# EasyEDA schematic 鱼缸监测_2021-03-13.json
TITLE: Sheet_1; REV: 1.0; Date: 2020-02-20; Sheet: 1/1; Drawn By: foggyhlw; Company: Your Company
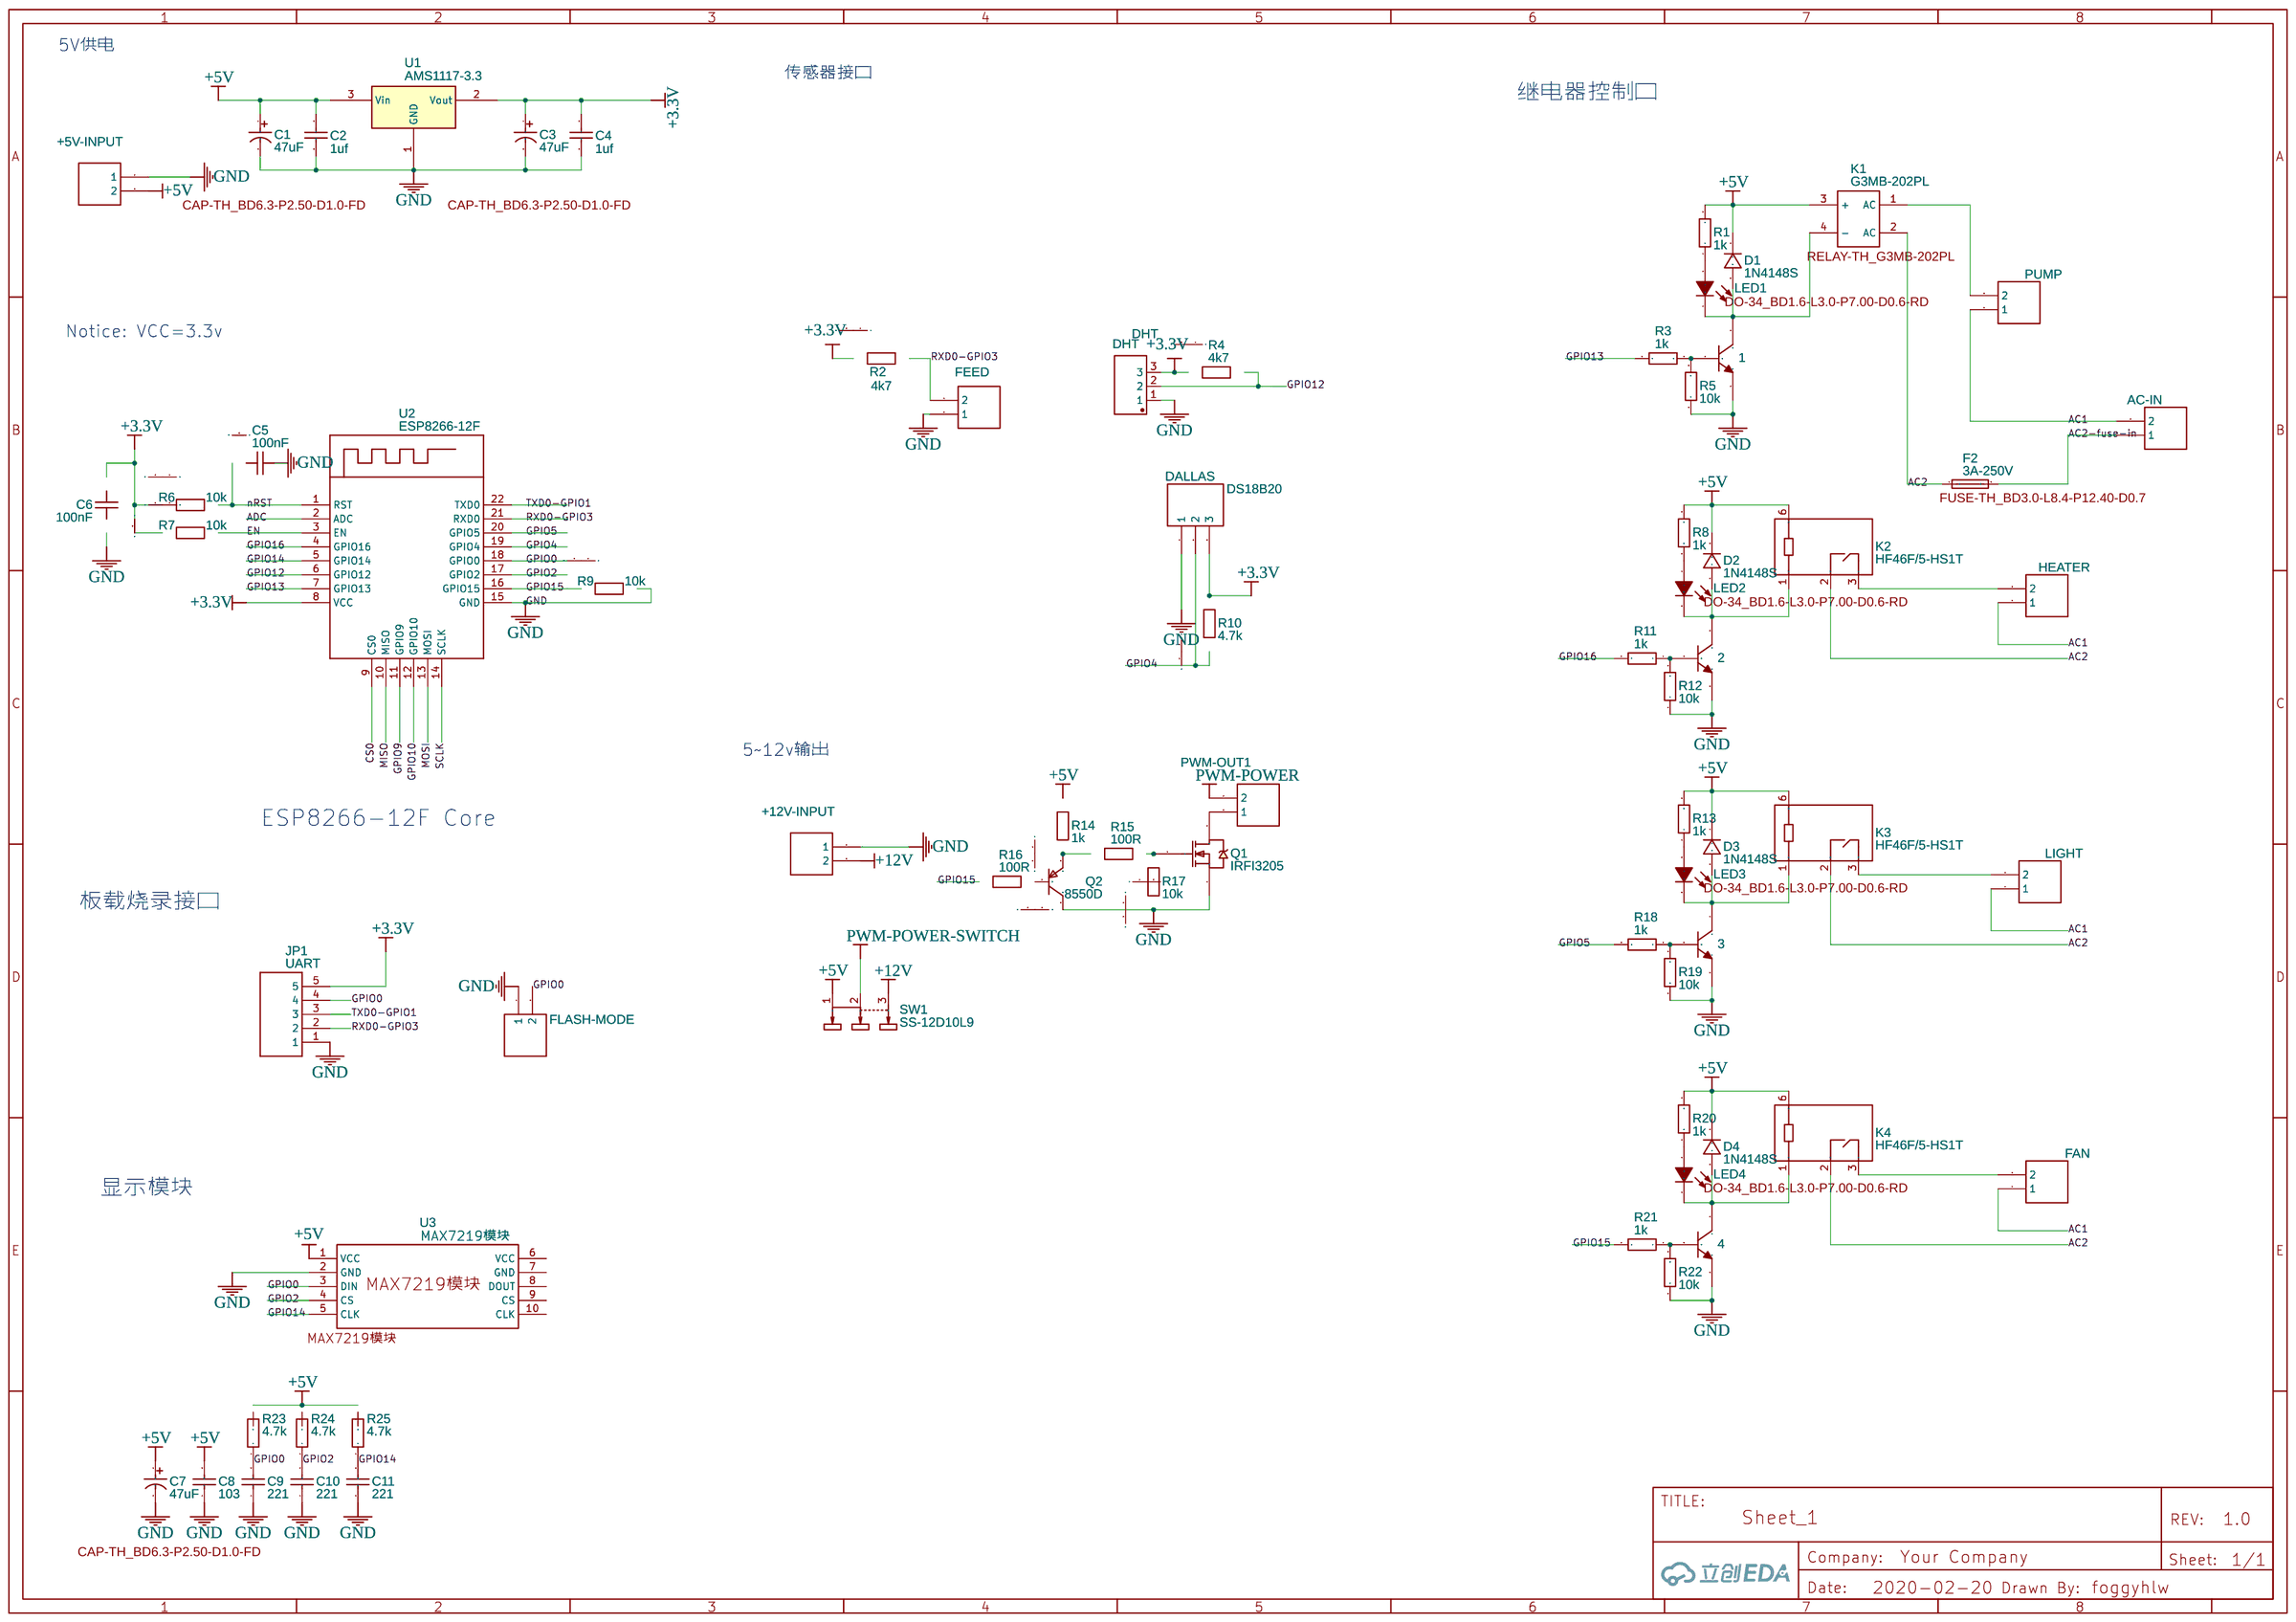
[diagram p0: schematic sheet]

## Parts
1  8050M-D  [TO-92-3_L4.8-W3.7-P2.54-R]
2  8050M-D  [TO-92-3_L4.8-W3.7-P2.54-R]
3  8050M-D  [TO-92-3_L4.8-W3.7-P2.54-R]
4  8050M-D  [TO-92-3_L4.8-W3.7-P2.54-R]
+5V-INPUT  SIP2  [CONN-TH_2P-P5.08_DB2EVC-5.08-2P]
+12V-INPUT  SIP2  [CONN-TH_2P-P5.08_DB2EVC-5.08-2P]
AC-IN  SIP2  [CONN-TH_2P-P5.08_DB2EVC-5.08-2P-BK]
C1  47uF  [CAP-TH_BD6.3-P2.50-D1.0-FD]
C2  1uf  [C0805]
C3  47uF  [CAP-TH_BD6.3-P2.50-D1.0-FD]
C4  1uf  [C0805]
C5  100nF  [C0603]
C6  100nF  [C0603]
C7  47uF  [CAP-TH_BD6.3-P2.50-D1.0-FD]
C8  103  [0603]
C9  221  [0603]
C10  221  [0603]
C11  221  [0603]
D1  1N4148S  [DO-34_BD1.6-L3.0-P7.00-D0.6-RD]
D2  1N4148S  [DO-34_BD1.6-L3.0-P7.00-D0.6-RD]
D3  1N4148S  [DO-34_BD1.6-L3.0-P7.00-D0.6-RD]
D4  1N4148S  [DO-34_BD1.6-L3.0-P7.00-D0.6-RD]
DALLAS  DS18B20  [HDR1X3]
DHT  DHT  [HDR1X3]
F2  3A-250V  [FUSE-TH_BD3.0-L8.4-P12.40-D0.7]
FAN  SIP2  [CONN-TH_2P-P5.08_DB2EV-5.08-2P-BK]
FEED  SIP2  [HDR1X2]
FLASH-MODE  SIP2  [HDR-TH_2P-P2.54-V-M]
HEATER  SIP2  [CONN-TH_2P-P5.08_DB2EVC-5.08-2P-BK]
JP1  UART  [HDR-TH_5P-P2.54-V_Z-211-0511-0021-001]
K1  G3MB-202PL  [RELAY-TH_G3MB-202PL]
K2  HF46F/5-HS1T  [RELAY-TH_HF46F/5-HS1T]
K3  HF46F/5-HS1T  [RELAY-TH_HF46F/5-HS1T]
K4  HF46F/5-HS1T  [RELAY-TH_HF46F/5-HS1T]
LED1  19-213/R6C-AN2Q1B/3T  [LED-TH_BD5.9-P2.54-FD]
LED2  19-213/R6C-AN2Q1B/3T  [LED-TH_BD5.9-P2.54-FD]
LED3  19-213/R6C-AN2Q1B/3T  [LED-TH_BD5.9-P2.54-FD]
LED4  19-213/R6C-AN2Q1B/3T  [LED-TH_BD5.9-P2.54-FD]
LIGHT  SIP2  [CONN-TH_2P-P5.08_DB2EVC-5.08-2P-BK]
PUMP  SIP2  [CONN-TH_2P-P5.08_DB2EVC-5.08-2P-BK]
PWM-OUT1  SIP2  [CONN-TH_2P-P5.08_DB2EVC-5.08-2P-BK]
Q1  IRFI3205  [TO-220-3_L10.0-W4.5-P2.54-L]
Q2  8550D  [TO-92-3_L4.8-W3.7-P2.54-R]
R1  1k  [R0805]
R2  4k7  [R0805]
R3  1k  [R0805]
R4  4k7  [R0805]
R5  10k  [R0805]
R6  10k  [R0805]
R7  10k  [R0805]
R8  1k  [R0805]
R9  10k  [R0805]
R10  4.7k  [R0805]
R11  1k  [R0805]
R12  10k  [R0805]
R13  1k  [R0805]
R14  1k  [R0805]
R15  100R  [R0805]
R16  100R  [R0805]
R17  10k  [R0805]
R18  1k  [R0805]
R19  10k  [R0805]
R20  1k  [R0805]
R21  1k  [R0805]
R22  10k  [R0805]
R23  4.7k  [R0805]
R24  4.7k  [R0805]
R25  4.7k  [R0805]
SW1  SS-12D10L9  [SW-TH_SS-12D10L9]
U1  AMS1117-3.3  [AMS1117]
U2  ESP8266-12F  [LGA22-2.0-24X16MM]
U3  MAX7219模块  [MAX7219模块]

## Library data of the parts
1-4 = -: Supplier: LCSC; Supplier Part: C305452; Manufacturer: BLUE ROCKET; Contributor: LCSC; LCSC Assembly: Yes
+5V-INPUT +12V-INPUT AC-IN DALLAS FAN FEED FLASH-MODE HEATER LIGHT PUMP PWM-OUT1 = -: catid: 20; Manufacturer Part: ?
C1 C3 C7 = 25V 47uF: Supplier: LCSC; Manufacturer: ValuePro; Manufacturer Part: 电解电容25V 47uF; Supplier Part: C45704; Package Display: Yes
C2 C4 = -: Capacitor; catid: 20; sourceId: aYgasJ1jB; Manufacturer Part: ?
C5 C6 = Capacitor: Manufacturer Part: ?
C8-C11 = Cap: Contributor: qjgdwxh; Package Display: No
D1-D4 = 1N4148S: Supplier: LCSC; Supplier Part: C179555; Manufacturer: Suzhou Good-Ark Elec; Contributor: LCSC; Package Display: Yes
DHT = -: Supplier: EasyEDA; Manufacturer Part: ?; Supplier Part: E8430
F2 = 3A-250V: Supplier: LCSC; Manufacturer Part: 保险管3A-250V,带引脚 双帽; Manufacturer: XCFuse; Supplier Part: C47403; Package Display: Yes
JP1 = 5PIN
K1 = G3MB-202PL: Supplier: LCSC; Manufacturer: OMRON; Supplier Part: C48654; Package Display: Yes
K2-K4 = HF46F/5-HS1T: Supplier: LCSC; Supplier Part: C182930; Manufacturer: Xiamen Hongfa Electroacoustic; Contributor: LCSC
LED1-LED4 = -: Supplier: LCSC; Supplier Part: C128251; Manufacturer: Everlight Elec; Contributor: LCSC
Q1 = -: HEXFET Power MOSFET
Q2 = 8550D: Supplier: LCSC; Manufacturer: SEMTECH; Contributor: LCSC; Supplier Part: C118549
R1 R3 R5 R8 R11-R13 R18-R22 = Res_0603(1/10W)_EU: Manufacturer Part: ?
R2 R4 R6 R7 R9 R10 R14-R17 R23-R25 = Resistor: Manufacturer Part: ?
SW1 = SS-12D10L9: Supplier: LCSC; Supplier Part: C319011; Manufacturer: XKB Enterprise; Contributor: LCSC
U1 = -: catid: 20; sourceId: 0Q2ZvNHZv; Manufacturer Part: ?
U2 = -: SMD ESP8266 based WiFi module FCC/CE; catid: 20; Manufacturer Part: ESP8266-12F/ESP-12F; sourceId: K4gQpZzx7
U3 = MAX7219模块: Contributor: Kano; Package Display: Yes

## Nets
+3.3V: C3.1 C4.2 C6.2 DALLAS.3 DHT.3 JP1.5 R2.1 R4.1 R6.1 R7.1 R10.2 U1.2(Vout) U2.8(VCC)
+5V: +5V-INPUT.2 C1.1 C2.2 C7.1 C8.2 D1.1 D2.1 D3.1 D4.1 K1.3(+) K2.6 K3.6 K4.6 R1.2 R8.2 R13.2 R14.2 R20.2 R23.2 R24.2 R25.2 SW1.1 U1.3(Vin) U3.1(VCC)
+12V: +12V-INPUT.2 SW1.3
GND: 1.3(E) 2.3(E) 3.3(E) 4.3(E) +5V-INPUT.1 +12V-INPUT.1 C1.2 C2.1 C3.2 C4.1 C5.2 C6.1 C7.2 C8.1 C9.1 C10.1 C11.1 DALLAS.1 DHT.1 FEED.1 FLASH-MODE.1 JP1.1 Q1.3(S) Q2.1(C) R5.1 R9.2 R12.1 R17.1 R19.1 R22.1 U1.1(GND) U2.15(GND) U3.2(GND)
AC1: AC-IN.2 FAN.1 HEATER.1 LIGHT.1 PUMP.1
AC2: F2.1 K1.2(AC) K2.2 K3.2 K4.2
AC2-fuse-in: AC-IN.1 F2.2
ADC: U2.2(ADC)
CS0: U2.9(CS0)
EN: R7.2 U2.3(EN)
GPIO0: C9.2 FLASH-MODE.2 JP1.4 R23.1 U2.18(GPIO0) U3.3(DIN)
GPIO2: C10.2 R24.1 U2.17(GPIO2) U3.4(CS)
GPIO4: DALLAS.2 R10.1 U2.19(GPIO4)
GPIO5: R18.2 U2.20(GPIO5)
GPIO9: U2.11(GPIO9)
GPIO10: U2.12(GPIO10)
GPIO12: DHT.2 R4.2 U2.6(GPIO12)
GPIO13: R3.2 U2.7(GPIO13)
GPIO14: C11.2 R25.1 U2.5(GPIO14) U3.5(CLK)
GPIO15: R9.1 R16.2 R21.2 U2.16(GPIO15)
GPIO16: R11.2 U2.4(GPIO16)
MISO: U2.10(MISO)
MOSI: U2.13(MOSI)
nRST: C5.1 R6.2 U2.1(RST)
PWM-POWER: PWM-OUT1.2
PWM-POWER-SWITCH: SW1.2
RXD0-GPIO3: FEED.2 JP1.2 R2.2 U2.21(RXD0)
SCLK: U2.14(SCLK)
TXD0-GPIO1: JP1.3 U2.22(TXD0)
Net-(1-1): 1.1(C) D1.2 K1.4(-) LED1.2(C)
Net-(1-2): 1.2(B) R3.1 R5.2
Net-(2-1): 2.1(C) D2.2 K2.1 LED2.2(C)
Net-(2-2): 2.2(B) R11.1 R12.2
Net-(3-1): 3.1(C) D3.2 K3.1 LED3.2(C)
Net-(3-2): 3.2(B) R18.1 R19.2
Net-(4-1): 4.1(C) D4.2 K4.1 LED4.2(C)
Net-(4-2): 4.2(B) R21.1 R22.2
Net-(FAN-2): FAN.2 K4.3
Net-(HEATER-2): HEATER.2 K2.3
Net-(K1-1): K1.1(AC) PUMP.2
Net-(K3-3): K3.3 LIGHT.2
Net-(LED1-1): LED1.1(A) R1.1
Net-(LED2-1): LED2.1(A) R8.1
Net-(LED3-1): LED3.1(A) R13.1
Net-(LED4-1): LED4.1(A) R20.1
Net-(PWM-OUT1-1): PWM-OUT1.1 Q1.2(D)
Net-(Q1-1): Q1.1(G) R15.1 R17.2
Net-(Q2-2): Q2.2(B) R16.1
Net-(Q2-3): Q2.3(E) R14.1 R15.2

Not connected (* = marked no-connect by the designer): U3 6(VCC) 7(GND) 8(DOUT) 9(CS) 10(CLK)

## Notes on the sheet
- 5V供电
- 传感器接口
- 继电器控制口
- Notice: VCC=3.3v
- 5~12v输出
- ESP8266-12F Core
- 板载烧录接口
- 显示模块
